# Altium schematic sheet L0 - Historie.SchDoc: Senzor
size 420 x 297 mm; Revision: Rev. 0; OrgName: MEgA - Měřící Energetické Aparáty, a.s.; Page Create Date: March  8, 1995; OrgAddr1: MEg74 - Senzor; Page Number: 1; Page Size: A3; Page Count: 2; Doc: M74R3; DsnPath: C:\Users\rtoth\Documents\GitHub\M74R\mega-original filesM74R2\M74R2.dsn; SchematicName: SCHEMATIC1; PageName: L0 - Historie; PageSize: A3; TopSchematic: True
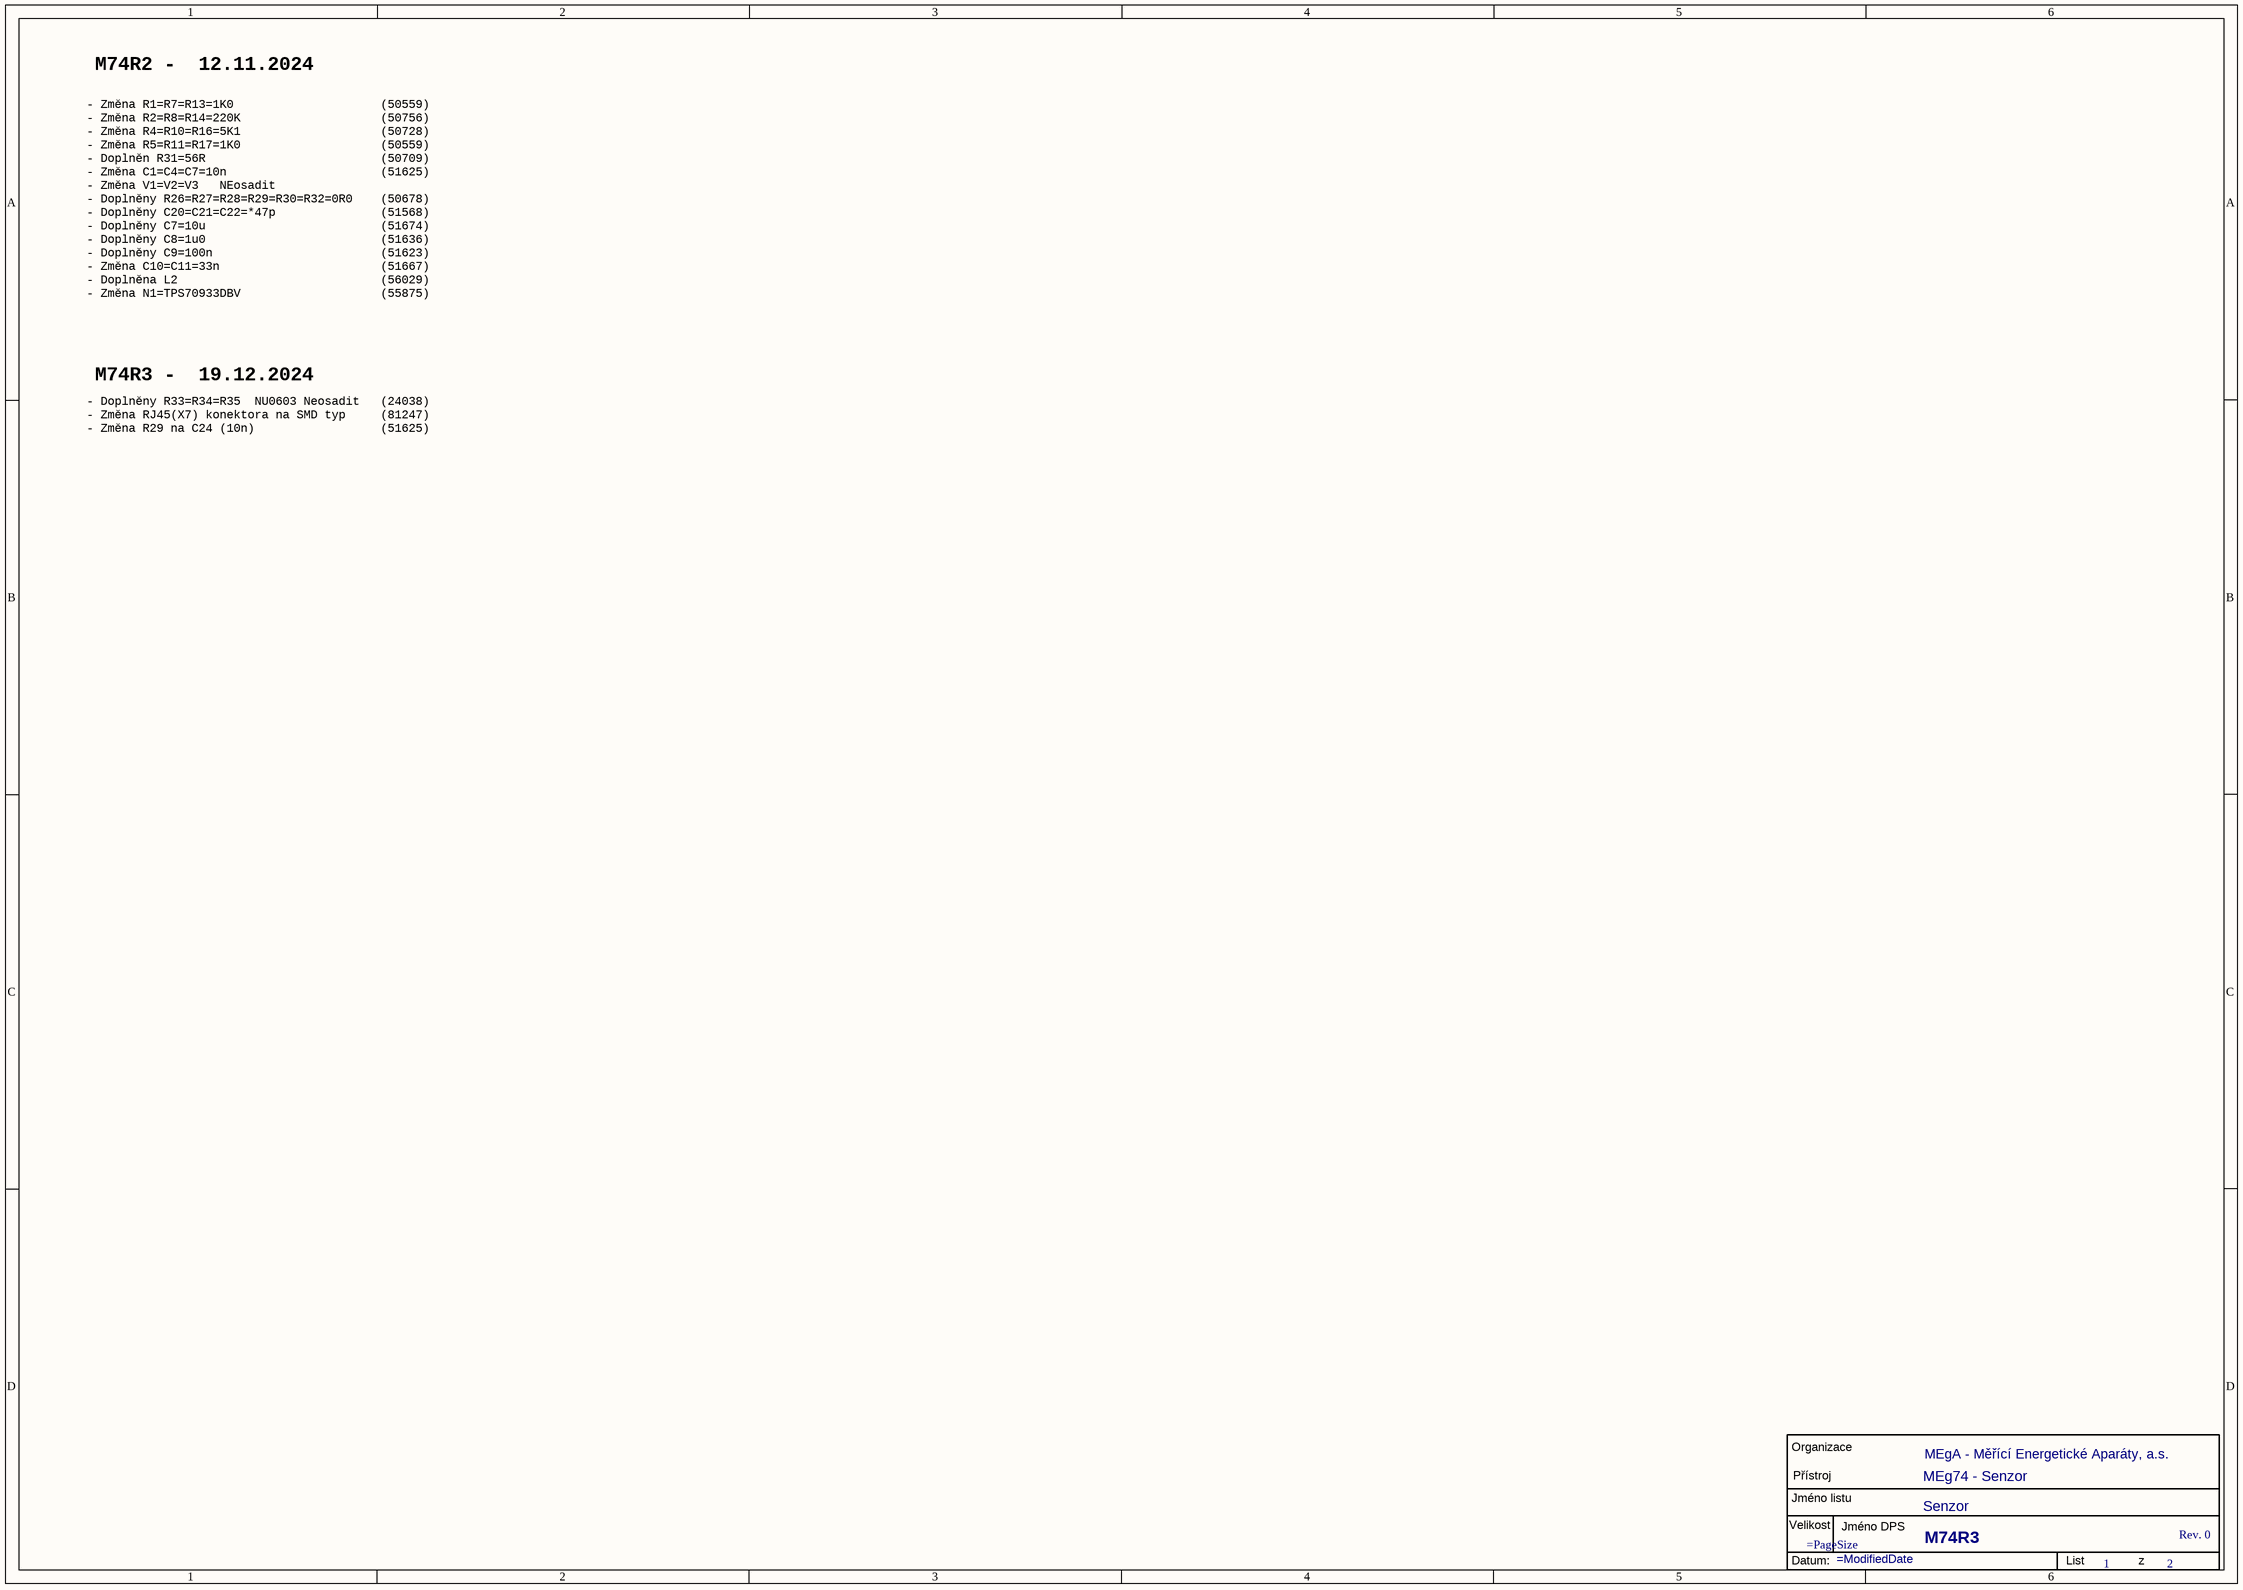
[diagram p0: L0 - Historie.SchDoc]

## Parts
*  Page Count: 2  Page Number: 1  OrgAddr1: MEg74 - Senzor  OrgName: MEgA - Měřící Energetické Aparáty, a.s.  Title: Senzor  RevCode: Rev. 0  Doc: M74R3  (graphical)

## Notes on the sheet
- - Změna R1=R7=R13=1K0                     (50559)
- - Změna R2=R8=R14=220K                    (50756)
- M74R2 -  12.11.2024
- - Změna C1=C4=C7=10n                      (51625)
- - Změna V1=V2=V3   NEosadit
- - Změna R4=R10=R16=5K1                    (50728)
- - Změna R5=R11=R17=1K0                    (50559)
- - Doplněn R31=56R                         (50709)
- - Doplněny R26=R27=R28=R29=R30=R32=0R0    (50678)
- - Doplněny C20=C21=C22=*47p               (51568)
- - Doplněny C7=10u                         (51674)
- - Doplněny C8=1u0                         (51636)
- - Doplněny C9=100n                        (51623)
- - Změna C10=C11=33n                       (51667)
- - Doplněna L2                             (56029)
- - Změna N1=TPS70933DBV                    (55875)
- M74R3 -  19.12.2024
- - Doplněny R33=R34=R35  NU0603 Neosadit   (24038)
- - Změna RJ45(X7) konektora na SMD typ     (81247)
- - Změna R29 na C24 (10n)                  (51625)
- (in symbol RAZITKO) Organizace; Přístroj; Jméno listu; Velikost; Jméno DPS; Datum:; List; z

## Library data of the parts
* = RAZITKO: Page Size: =PageSize; Page Create Date: March  8, 1995; Page Modify Date: =ModifiedDate